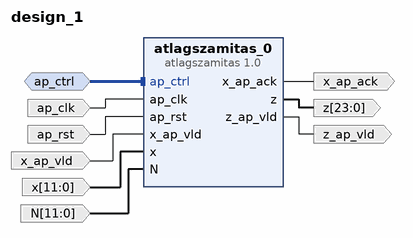
[diagram p0: block diagram of the top level]
# Vivado block design design_1, Vivado 2016.2
create_bd_design design_1

create_bd_intf_port -mode Slave -vlnv xilinx.com:interface:acc_handshake_rtl:1.0 ap_ctrl
create_bd_port -dir I -type clk ap_clk
set_property -dict {CONFIG.FREQ_HZ 100000000} [get_bd_ports ap_clk]
create_bd_port -dir I -type rst ap_rst
set_property -dict {CONFIG.POLARITY ACTIVE_HIGH} [get_bd_ports ap_rst]
create_bd_port -dir I x_ap_vld
create_bd_port -dir I -from 11 -to 0 -type data x
set_property -dict [list \
  CONFIG.LAYERED_METADATA {xilinx.com:interface:datatypes:1.0 {DATA {datatype {name {attribs {resolve_type immediate dependency {} format string minimum {} maximum {}} value {}} bitwidth {attribs {resolve_type immediate dependency {} format long minimum {} maximum {}} value 12} bitoffset {attribs {resolve_type immediate dependency {} format long minimum {} maximum {}} value 0} integer {signed {attribs {resolve_type immediate dependency {} format bool minimum {} maximum {}} value true}}}}}} \
] [get_bd_ports x]
create_bd_port -dir I -from 11 -to 0 -type data N
set_property -dict [list \
  CONFIG.LAYERED_METADATA {xilinx.com:interface:datatypes:1.0 {DATA {datatype {name {attribs {resolve_type immediate dependency {} format string minimum {} maximum {}} value {}} bitwidth {attribs {resolve_type immediate dependency {} format long minimum {} maximum {}} value 12} bitoffset {attribs {resolve_type immediate dependency {} format long minimum {} maximum {}} value 0} integer {signed {attribs {resolve_type immediate dependency {} format bool minimum {} maximum {}} value true}}}}}} \
] [get_bd_ports N]
create_bd_port -dir O -from 23 -to 0 -type data z
create_bd_port -dir O z_ap_vld
create_bd_port -dir O x_ap_ack

create_bd_cell -type ip -vlnv xilinx.com:hls:atlagszamitas:1.0 atlagszamitas_0

# ---- connections ----

connect_bd_intf_net [get_bd_intf_ports ap_ctrl] [get_bd_intf_pins atlagszamitas_0/ap_ctrl]
connect_bd_net [get_bd_ports ap_clk] [get_bd_pins atlagszamitas_0/ap_clk]
connect_bd_net [get_bd_ports ap_rst] [get_bd_pins atlagszamitas_0/ap_rst]
connect_bd_net [get_bd_ports x_ap_vld] [get_bd_pins atlagszamitas_0/x_ap_vld]
connect_bd_net [get_bd_ports x] [get_bd_pins atlagszamitas_0/x]
connect_bd_net [get_bd_ports N] [get_bd_pins atlagszamitas_0/N]
connect_bd_net [get_bd_pins atlagszamitas_0/z] [get_bd_ports z]
connect_bd_net [get_bd_pins atlagszamitas_0/z_ap_vld] [get_bd_ports z_ap_vld]
connect_bd_net [get_bd_pins atlagszamitas_0/x_ap_ack] [get_bd_ports x_ap_ack]

validate_bd_design
save_bd_design
